# Altium schematic sheet LoraSTM32_2.SchDoc
size 420 x 297 mm; Organization: Altium Limited; Address1: L3, 12a Rodborough Rd; Address2: Frenchs Forest; Address3: NSW; Address4: Australia 2086; Scale: 1:1; Разраб.: Волков М.А.; Обозначение документа: МГТУ.143014.005 Э3; Пров.: Рафиков А.Г.; Утв.: Рафиков А.Г.; Номер листа: 1; Общее количество листов: 1; Масштаб: 1:1; Наименование организации: МГТУ. им. Н.Э. Баумана ИУ8; Перв. применение: МГТУ.143014.005; Наименование изделия 1: Модуль LoRaSTM32 - Safe; Наименование изделия 2: Схема электрическая; Наименование изделия 3: принципиальная; Нач. отд.: Нач. отд.
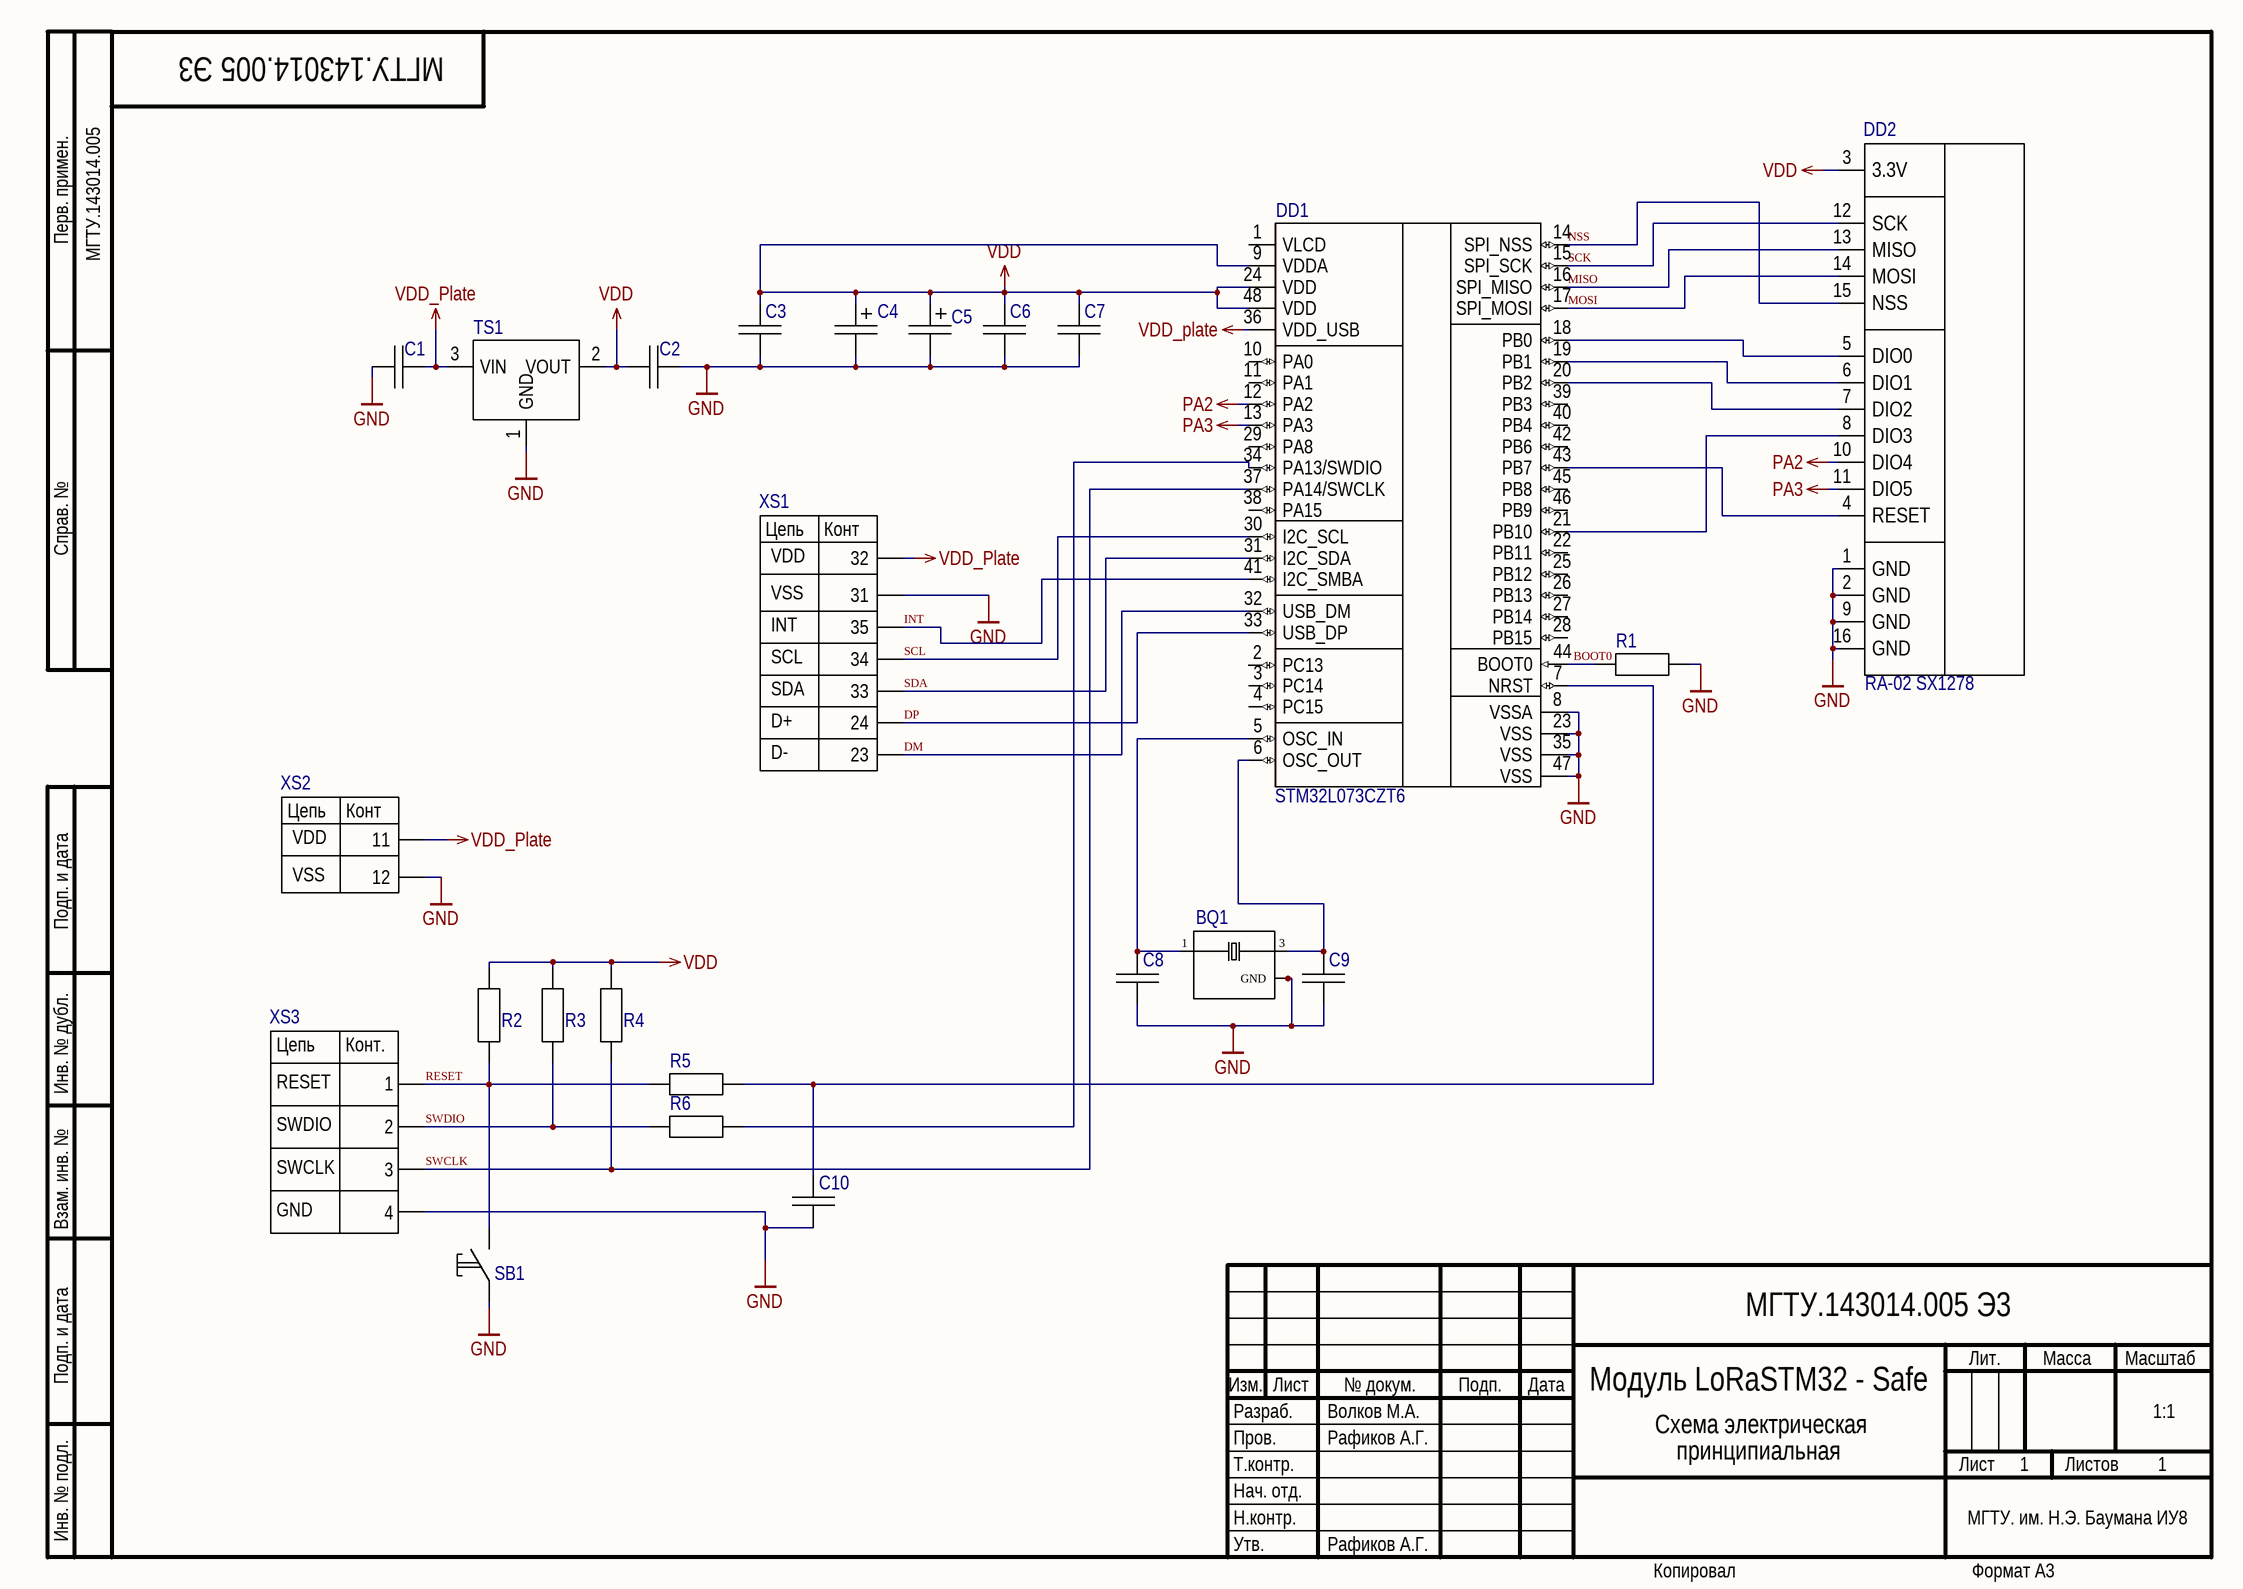
[diagram p0: LoraSTM32_2.SchDoc]

## Parts
BQ1  NX3225GA  [NDK_NX3225GA_0]  (value not drawn)
C1  *  [CAPC1608X09L]  (value not drawn)
C2  *  [CAPC1608X09L]  (value not drawn)
C3  *  [CAPC1608X09L]  (value not drawn)
C4  *  [CAPMP3216X16N-A]  (value not drawn)
C5  *  [CAPMP3216X16N-A]  (value not drawn)
C6  GRM188R72A104KA35D  [CAPC1608X09L]  (value not drawn)
C7  *  [CAPC1608X09L]  (value not drawn)
C8  *  [CAPC1608X09L]  (value not drawn)
C9  *  [CAPC1608X09L]  (value not drawn)
C10  *  [CAPC1608X09L]  (value not drawn)
DD1  STM32L073CZT6  [*QFP50P900X900X160-48N]
DD2  RA-02 SX1278  [RA-02]
R1  R1608  [RESC1608X05N]  (value not drawn)
R2  R1608  [RESC1608X05N]  (value not drawn)
R3  R1608  [RESC1608X05N]  (value not drawn)
R4  R1608  [RESC1608X05N]  (value not drawn)
R5  R1608  [RESC1608X05N]  (value not drawn)
R6  R1608  [RESC1608X05N]  (value not drawn)
SB1  1437566-3 (FSMSM)  [*SW_1437566-4]  (value not drawn)
TS1  LD1117S33CTR  [*SOT223]  (value not drawn)
XS1  PBS-20  [PBS-20]  (value not drawn)
XS2  PBS-20  [PBS-20 - 13]  (value not drawn)
XS3  PBS-4  [PBS-4]  (value not drawn)

## Nets
GND: BQ1.2(GND) BQ1.4(GND) C1.2 C2.1 C3.2 C4.2 C5.2 C6.2 C7.2 C8.1 C9.1 C10.2 DD1.8(VSSA) DD1.23(VSS) DD1.35(VSS) DD1.47(VSS) DD2.1(GND) DD2.2(GND) DD2.9(GND) DD2.16(GND) R1.1 SB1.1 TS1.1(GND) XS1.10(31) XS2.12 XS3.4
PA2: DD1.12(PA2) DD2.10(DIO4)
PA3: DD1.13(PA3) DD2.11(DIO5)
VDD: C2.2 C3.1 C4.1 C5.1 C6.1 C7.1 DD1.9(VDDA) DD1.24(VDD) DD1.48(VDD) DD2.3(3.3V) R2.1 R3.1 R4.1 TS1.2(VOUT)
VDD_Plate: C1.1 DD1.36(VDD_USB) TS1.3(VIN) XS1.9(32) XS2.11
BOOT0: DD1.44(BOOT0) R1.2
DM: DD1.32(USB_DM) XS1.18(23)
DP: DD1.33(USB_DP) XS1.17(24)
INT: DD1.41(I2C_SMBA) XS1.6(35)
MISO: DD1.16(SPI_MISO) DD2.13(MISO)
MOSI: DD1.17(SPI_MOSI) DD2.14(MOSI)
NSS: DD1.14(SPI_NSS) DD2.15(NSS)
RESET: R2.2 R5.2 SB1.2 XS3.1
SCK: DD1.15(SPI_SCK) DD2.12(SCK)
SCL: DD1.30(I2C_SCL) XS1.7(34)
SDA: DD1.31(I2C_SDA) XS1.8(33)
SWCLK: DD1.37(PA14/SWCLK) R4.2 XS3.3
SWDIO: R3.2 R6.2 XS3.2
NetBQ1_1: BQ1.1 C8.2 DD1.5(OSC_IN)
NetBQ1_3: BQ1.3 C9.2 DD1.6(OSC_OUT)
NetC10_1: C10.1 DD1.7(NRST) R5.1
NetDD1_18: DD1.18(PB0) DD2.5(DIO0)
NetDD1_19: DD1.19(PB1) DD2.6(DIO1)
NetDD1_20: DD1.20(PB2) DD2.7(DIO2)
NetDD1_21: DD1.21(PB10) DD2.8(DIO3)
NetDD1_34: DD1.34(PA13/SWDIO) R6.1
NetDD1_43: DD1.43(PB7) DD2.4(RESET)

Not connected (* = marked no-connect by the designer): DD1 1(VLCD) 2(PC13) 3(PC14) 4(PC15) 10(PA0) 11(PA1) 22(PB11) 25(PB12) 26(PB13) 27(PB14) 28(PB15) 29(PA8) 38(PA15) 39(PB3) 40(PB4) 42(PB6) 45(PB8) 46(PB9)

## Notes on the sheet
- Перв. примен.
- Справ. №
- Подп. и дата
- Инв. № дубл.
- Взам. инв. №
- Разраб.
- Изм.
- Лист
- № докум.
- Подп.
- Дата
- Лит.
- Масса
- Масштаб
- Пров.
- Т.контр.
- Листов
- Инв. № подл.
- Утв.
- Н.контр.
- Копировал
- Формат А3
- (in symbol PBS-20_1) Цепь; Конт; VDD; VSS
- (in symbol PBS_20_2) Цепь; Конт; VDD; VSS; INT; SCL; SDA; D+; D-
- (in symbol отладка swd) Цепь; Конт.; RESET; SWDIO; SWCLK; GND

## Library data of the parts
BQ1 = NX3225GA-25MHZ: NX3225GA-25MHZ 8pF, 25 МГц, 30/20ppm, 8пФ, -40...+85°C, SMD 3.2*2.5*0.75мм, Кварцевый резонатор; MF: NDK America, Inc.; Package: SMD-4 NDK America, Inc.; MP: NX3225GA-25MHZ 8pF; Availability: Unavailable; SnapEDA_Link: https://www.snapeda.com/parts/NX2520SA-24.000000MHZ-B8/NDK%20America%2C%20Inc./view-part/?ref=snap; Price: None; Value: *; ComponentLink1Description: buy; ComponentLink1URL: https://www.chipdip.ru/product0/9000523947; ComponentLink2Description: datasheet; ComponentLink2URL: https://static.chipdip.ru/lib/014/DOC004014815.pdf
C1 = CC1608: Конденсатор 1.6x0.8 мм; Tolerance: ±10%; ТКЕ: X7R; РКД Наименование: CC1608M - NP0 - 16 V - 10 nF ±10%; GRM21BR71C105KA01L: 100n; Voltage: *; Type: *; PartNo: *; Supplier Part Number 1: *; Supplier 1: *
C2 = CC1608: Конденсатор 1.6x0.8 мм; Tolerance: ±10%; ТКЕ: X7R; РКД Наименование: CC1608M - NP0 - 16 V - 10 nF ±10%; GRM21BR71C105KA01L: 10u; Voltage: *; Type: *; PartNo: *; Supplier Part Number 1: *; Supplier 1: *
C3 C6 C7 C10 = CC1608: Конденсатор 1.6x0.8 мм; Tolerance: ±10%; ТКЕ: X7R; РКД Наименование: CC1608M - NP0 - 16 V - 10 nF ±10%; GRM188R71H104K: 100nF; Voltage: *; Type: *; PartNo: *; Supplier Part Number 1: *; Supplier 1: *
C4 = CT3216-A: Tantalum Surface Mount Capacitor, Size A; TECAP1/16VA10: 1uF; Voltage: 6.3V; Type: *; PartNo: *; Supplier Part Number 1: *; Supplier 1: *
C5 = CT3216-A: Tantalum Surface Mount Capacitor, Size A; TECAP10/10VA10: 10uF; Voltage: 6.3V; Type: *; PartNo: *; Supplier Part Number 1: *; Supplier 1: *
C8 = CC1608: Конденсатор 1.6x0.8 мм; Tolerance: ±10%; ТКЕ: X7R; РКД Наименование: CC1608M - NP0 - 16 V - 10 nF ±10%; GRM1885C1H240J: 24pF; Voltage: *; Type: *; PartNo: *; Supplier Part Number 1: *; Supplier 1: *
C9 = CC1608: Конденсатор 1.6x0.8 мм; Tolerance: ±10%; ТКЕ: X7R; РКД Наименование: CC1608M - NP0 - 16 V - 10 nF ±10%; GRM1887U1H472JA01D: 24pF; Voltage: *; Type: *; PartNo: *; Supplier Part Number 1: *; Supplier 1: *
DD1 = STM32L073CZT6: / ARMВ® CortexВ®-M0+ STM32 L0 Microcontroller IC 32-Bit 32MHz 192KB _192K x 8_ FLASH 48-LQFP /; MF: STMicroelectronics; SnapEDA_Link: https://www.snapeda.com/parts/STM32L073CZT6/STMicroelectronics/view-part/?ref=snap; Digi-Key_Purchase_URL: https://www.digikey.com/product-detail/en/stmicroelectronics/STM32L073CZT6/497-17506-ND/8024098?utm_source=snapeda&utm_medium=aggregator&utm_campaign=symbol; MP: STM32L073CZT6; Package: LQFP-48 STMicroelectronics; Digi-Key_Part_Number: 497-17506-ND; Value: *
DD2 = RA-02
R1 R5 R6 = R1608: Резистор 1.6x0.8 мм; Tolerance: ±1%; РКД Наименование: RC1608M - 22 Ohm ±1%; Value: 22; Type: *; PartNo: *; Supplier 1: *; Supplier Part Number 1: *
R2-R4 = R1608: Резистор 1.6x0.8 мм; Tolerance: ±1%; РКД Наименование: RC1608M - 22 Ohm ±1%; Value: 10k; Type: *; PartNo: *; Supplier 1: *; Supplier Part Number 1: *
SB1 = FSMSM: 1437566-3 (FSMSM), Кнопка тактовая h=4.6 мм SMD SPST Switch Tactile / Switch Tactile OFF (ON) SPST Rectangular Button Gull Wing 0.05A 24VDC SMD Loose; Произвдитель: TE Connectivity; Артикул: 1437566-3 (FSMSM); ComponentLink1Description: buy; ComponentLink1URL: https://www.chipdip.ru/product/tyco-1437566-3-fsmsm; ComponentLink2Description: datasheet; ComponentLink2URL: https://static.chipdip.ru/lib/071/DOC000071159.pdf
TS1 = LD1117S33CTR: Linear Regulator / LDO Regulator Pos 3.3V 1.3A 4-Pin(3+Tab) SOT-223 T/R; Code_IPC: SOT-223; PackageVersion: revBB, Aug-2009; PackageReference: SOT-223; PackageDescription: 3-Lead Plastic Small Outline Transistor (TT) [SOT-23]; DatasheetVersion: revB, Feb-2007; PartNumber: LD1117S33CTR; ComponentLink1Description: buy; ComponentLink1URL: https://www.chipdip.ru/product/ld1117s33ctr-2; ComponentLink2Description: datasheet; ComponentLink2URL: https://static.chipdip.ru/lib/292/DOC000292513.pdf
XS1 = PBS_20_2
XS2 = PBS-20_1: ComponentLink1Description: datasheet; ComponentLink1URL: https://static.chipdip.ru/lib/226/DOC000226931.pdf; ComponentLink2Description: buy; ComponentLink2URL: https://www.chipdip.ru/catalog-show/pin-connectors-and-sockets?x.698=ZGQ&gq=PBS
XS3 = отладка swd: 2.54mm swdio; ComponentLink1Description: 3d; ComponentLink1URL: https://www.3dcontentcentral.com/secure/download-model.aspx?catalogid=171&id=455493; ComponentLink2Description: https://www.chipdip.ru/product/pld-6; ComponentLink2URL: https://www.chipdip.ru/product/pld-6